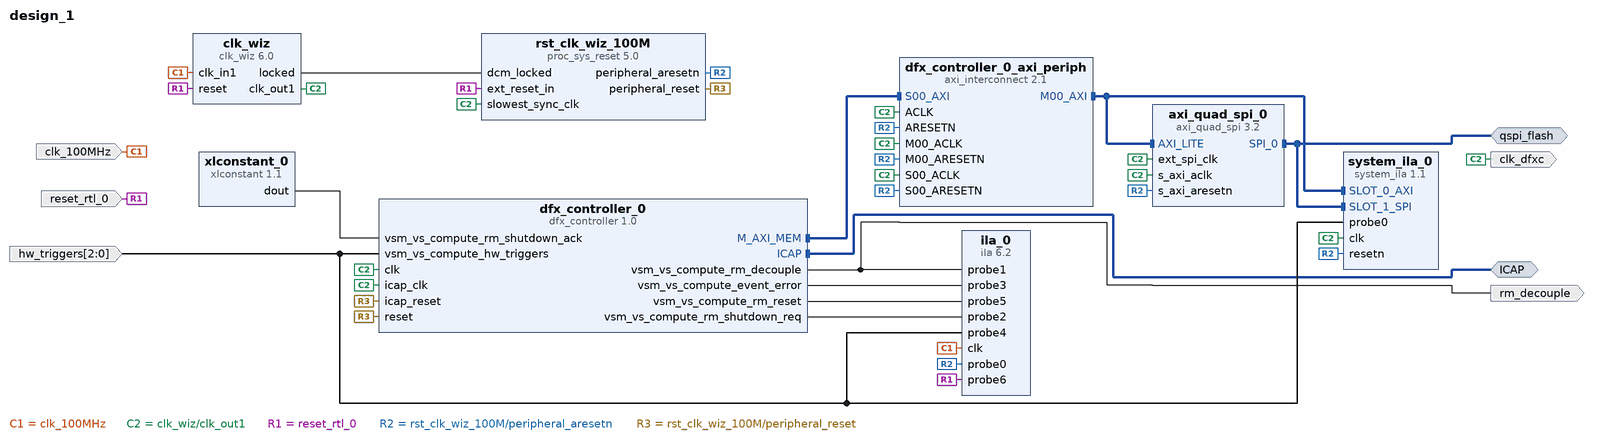
[diagram p0: block diagram of the top level]
# Vivado block design design_1, xc7a35ticsg324-1L, Vivado 2024.1
create_bd_design design_1

create_bd_intf_port -mode Master -vlnv xilinx.com:interface:icap_rtl:1.0 ICAP
create_bd_intf_port -mode Master -vlnv xilinx.com:interface:spi_rtl:1.0 qspi_flash
create_bd_port -dir I -type clk clk_100MHz
set_property -dict {CONFIG.FREQ_HZ 100000000} [get_bd_ports clk_100MHz]
create_bd_port -dir I -type rst reset_rtl_0
set_property -dict {CONFIG.POLARITY ACTIVE_HIGH} [get_bd_ports reset_rtl_0]
create_bd_port -dir O rm_decouple
create_bd_port -dir O clk_dfxc
create_bd_port -dir I -from 2 -to 0 hw_triggers

create_bd_cell -type ip -vlnv xilinx.com:ip:dfx_controller:1.0 dfx_controller_0
set_property -dict [list \
  CONFIG.ALL_PARAMS {['HAS_AXI_LITE_IF 0', 'RESET_ACTIVE_LEVEL 1', 'CP_FIFO_DEPTH 32', 'CP_FIFO_TYPE lutram', 'CDC_STAGES 2', 'VS {', 'vs_compute {ID 0 NAME vs_compute RM {DONUT {ID 0 NAME DONUT BS {0 {ID 0 ADDR 196608 SIZE 164544 CLEAR 0}}} example {ID 1 NAME example BS {0 {ID 0 ADDR 0 SIZE 164544 CLEAR 0}}}} POR_RM DONUT', 'NUM_HW_TRIGGERS 3 NUM_TRIGGERS_ALLOCATED 4 HAS_POR_RM 1 HAS_AXIS_CONTROL 0 HAS_AXIS_STATUS 0}', '}', 'CP_FAMILY 7series', 'DIRTY 3', 'CP_ARBITRATION_PROTOCOL 1']} \
  CONFIG.GUI_BS_SIZE_0 164544 \
  CONFIG.GUI_CDC_STAGES 2 \
  CONFIG.GUI_CP_ARBITRATION_PROTOCOL 1 \
  CONFIG.GUI_HAS_AXI_LITE false \
  CONFIG.GUI_RESET_ACTIVE_LEVEL 1 \
  CONFIG.GUI_RM_NEW_NAME DONUT \
  CONFIG.GUI_SELECT_RM 0 \
  CONFIG.GUI_VS_NEW_NAME vs_compute \
  CONFIG.GUI_VS_NUM_HW_TRIGGERS 3 \
] [get_bd_cells dfx_controller_0]
create_bd_cell -type ip -vlnv xilinx.com:ip:clk_wiz:6.0 clk_wiz
set_property -dict {CONFIG.CLKOUT1_REQUESTED_OUT_FREQ 100} [get_bd_cells clk_wiz]
create_bd_cell -type ip -vlnv xilinx.com:ip:proc_sys_reset:5.0 rst_clk_wiz_100M
create_bd_cell -type ip -vlnv xilinx.com:ip:axi_interconnect:2.1 dfx_controller_0_axi_periph
set_property -dict {CONFIG.NUM_MI 1} [get_bd_cells dfx_controller_0_axi_periph]
create_bd_cell -type ip -vlnv xilinx.com:ip:axi_quad_spi:3.2 axi_quad_spi_0
set_property -dict {CONFIG.QSPI_BOARD_INTERFACE qspi_flash CONFIG.USE_BOARD_FLOW true} [get_bd_cells axi_quad_spi_0]
create_bd_cell -type ip -vlnv xilinx.com:ip:ila:6.2 ila_0
set_property -dict {CONFIG.C_MONITOR_TYPE Native CONFIG.C_NUM_OF_PROBES 7 CONFIG.C_PROBE4_WIDTH 3} [get_bd_cells ila_0]
create_bd_cell -type ip -vlnv xilinx.com:ip:xlconstant:1.1 xlconstant_0
create_bd_cell -type ip -vlnv xilinx.com:ip:system_ila:1.1 system_ila_0
set_property -dict [list \
  CONFIG.ALL_PROBE_SAME_MU_CNT 1 \
  CONFIG.C_MON_TYPE MIX \
  CONFIG.C_NUM_MONITOR_SLOTS 2 \
  CONFIG.C_NUM_OF_PROBES 1 \
  CONFIG.C_PROBE0_WIDTH 3 \
  CONFIG.C_PROBE_WIDTH_PROPAGATION MANUAL \
  CONFIG.C_SLOT_0_APC_EN 0 \
  CONFIG.C_SLOT_0_AXI_AR_SEL_DATA 1 \
  CONFIG.C_SLOT_0_AXI_AR_SEL_TRIG 1 \
  CONFIG.C_SLOT_0_AXI_AW_SEL_DATA 1 \
  CONFIG.C_SLOT_0_AXI_AW_SEL_TRIG 1 \
  CONFIG.C_SLOT_0_AXI_B_SEL_DATA 1 \
  CONFIG.C_SLOT_0_AXI_B_SEL_TRIG 1 \
  CONFIG.C_SLOT_0_AXI_R_SEL_DATA 1 \
  CONFIG.C_SLOT_0_AXI_R_SEL_TRIG 1 \
  CONFIG.C_SLOT_0_AXI_W_SEL_DATA 1 \
  CONFIG.C_SLOT_0_AXI_W_SEL_TRIG 1 \
  CONFIG.C_SLOT_0_INTF_TYPE xilinx.com:interface:aximm_rtl:1.0 \
  CONFIG.C_SLOT_1_INTF_TYPE xilinx.com:interface:spi_rtl:1.0 \
  CONFIG.C_SLOT_1_TYPE 0 \
  CONFIG.C_TRIGIN_EN false \
] [get_bd_cells system_ila_0]

# ---- connections ----

connect_bd_intf_net -intf_net axi_quad_spi_0_SPI_0 [get_bd_intf_ports qspi_flash] [get_bd_intf_pins axi_quad_spi_0/SPI_0]
connect_bd_intf_net [get_bd_intf_ports qspi_flash] [get_bd_intf_pins system_ila_0/SLOT_1_SPI]
connect_bd_intf_net [get_bd_intf_ports ICAP] [get_bd_intf_pins dfx_controller_0/ICAP]
connect_bd_intf_net [get_bd_intf_pins dfx_controller_0/M_AXI_MEM] [get_bd_intf_pins dfx_controller_0_axi_periph/S00_AXI]
connect_bd_intf_net -intf_net dfx_controller_0_axi_periph_M00_AXI [get_bd_intf_pins dfx_controller_0_axi_periph/M00_AXI] [get_bd_intf_pins axi_quad_spi_0/AXI_LITE]
connect_bd_intf_net [get_bd_intf_pins dfx_controller_0_axi_periph/M00_AXI] [get_bd_intf_pins system_ila_0/SLOT_0_AXI]
connect_bd_net [get_bd_ports clk_100MHz] [get_bd_pins clk_wiz/clk_in1] [get_bd_pins ila_0/clk]
connect_bd_net [get_bd_pins clk_wiz/clk_out1] \
  [get_bd_pins axi_quad_spi_0/ext_spi_clk] [get_bd_pins axi_quad_spi_0/s_axi_aclk] \
  [get_bd_pins dfx_controller_0_axi_periph/M00_ACLK] [get_bd_pins dfx_controller_0_axi_periph/S00_ACLK] \
  [get_bd_pins dfx_controller_0/icap_clk] [get_bd_pins dfx_controller_0_axi_periph/ACLK] \
  [get_bd_pins rst_clk_wiz_100M/slowest_sync_clk] [get_bd_ports clk_dfxc] [get_bd_pins dfx_controller_0/clk] \
  [get_bd_pins system_ila_0/clk]
connect_bd_net [get_bd_pins clk_wiz/locked] [get_bd_pins rst_clk_wiz_100M/dcm_locked]
connect_bd_net [get_bd_pins dfx_controller_0/vsm_vs_compute_event_error] [get_bd_pins ila_0/probe3]
connect_bd_net [get_bd_pins dfx_controller_0/vsm_vs_compute_rm_decouple] [get_bd_pins ila_0/probe1] [get_bd_ports rm_decouple]
connect_bd_net [get_bd_pins dfx_controller_0/vsm_vs_compute_rm_reset] [get_bd_pins ila_0/probe5]
connect_bd_net [get_bd_pins dfx_controller_0/vsm_vs_compute_rm_shutdown_req] [get_bd_pins ila_0/probe2]
connect_bd_net -net reset_rtl_0_1 [get_bd_ports reset_rtl_0] \
  [get_bd_pins clk_wiz/reset] [get_bd_pins rst_clk_wiz_100M/ext_reset_in] [get_bd_pins ila_0/probe6]
connect_bd_net [get_bd_pins rst_clk_wiz_100M/peripheral_aresetn] \
  [get_bd_pins axi_quad_spi_0/s_axi_aresetn] [get_bd_pins dfx_controller_0_axi_periph/M00_ARESETN] \
  [get_bd_pins dfx_controller_0_axi_periph/S00_ARESETN] [get_bd_pins dfx_controller_0_axi_periph/ARESETN] \
  [get_bd_pins ila_0/probe0] [get_bd_pins system_ila_0/resetn]
connect_bd_net -net util_vector_logic_1_Res [get_bd_pins rst_clk_wiz_100M/peripheral_reset] \
  [get_bd_pins dfx_controller_0/icap_reset] [get_bd_pins dfx_controller_0/reset]
connect_bd_net -net vsm_VS_0_hw_triggers_0_1 [get_bd_ports hw_triggers] \
  [get_bd_pins ila_0/probe4] [get_bd_pins dfx_controller_0/vsm_vs_compute_hw_triggers] [get_bd_pins system_ila_0/probe0]
connect_bd_net [get_bd_pins xlconstant_0/dout] [get_bd_pins dfx_controller_0/vsm_vs_compute_rm_shutdown_ack]
set_property HDL_ATTRIBUTE.DEBUG true [get_bd_intf_nets axi_quad_spi_0_SPI_0]
set_property HDL_ATTRIBUTE.MARK_DEBUG true [get_bd_intf_nets axi_quad_spi_0_SPI_0]
set_property HDL_ATTRIBUTE.DEBUG true [get_bd_intf_nets dfx_controller_0_axi_periph_M00_AXI]
set_property HDL_ATTRIBUTE.MARK_DEBUG true [get_bd_intf_nets dfx_controller_0_axi_periph_M00_AXI]

# ---- address map ----
assign_bd_address -offset 0x44A00000 -range 64K -target_address_space [get_bd_addr_spaces dfx_controller_0/Data] [get_bd_addr_segs axi_quad_spi_0/AXI_LITE/Reg]

validate_bd_design
save_bd_design
